# Altium schematic sheet Voeding.SchDoc
size A
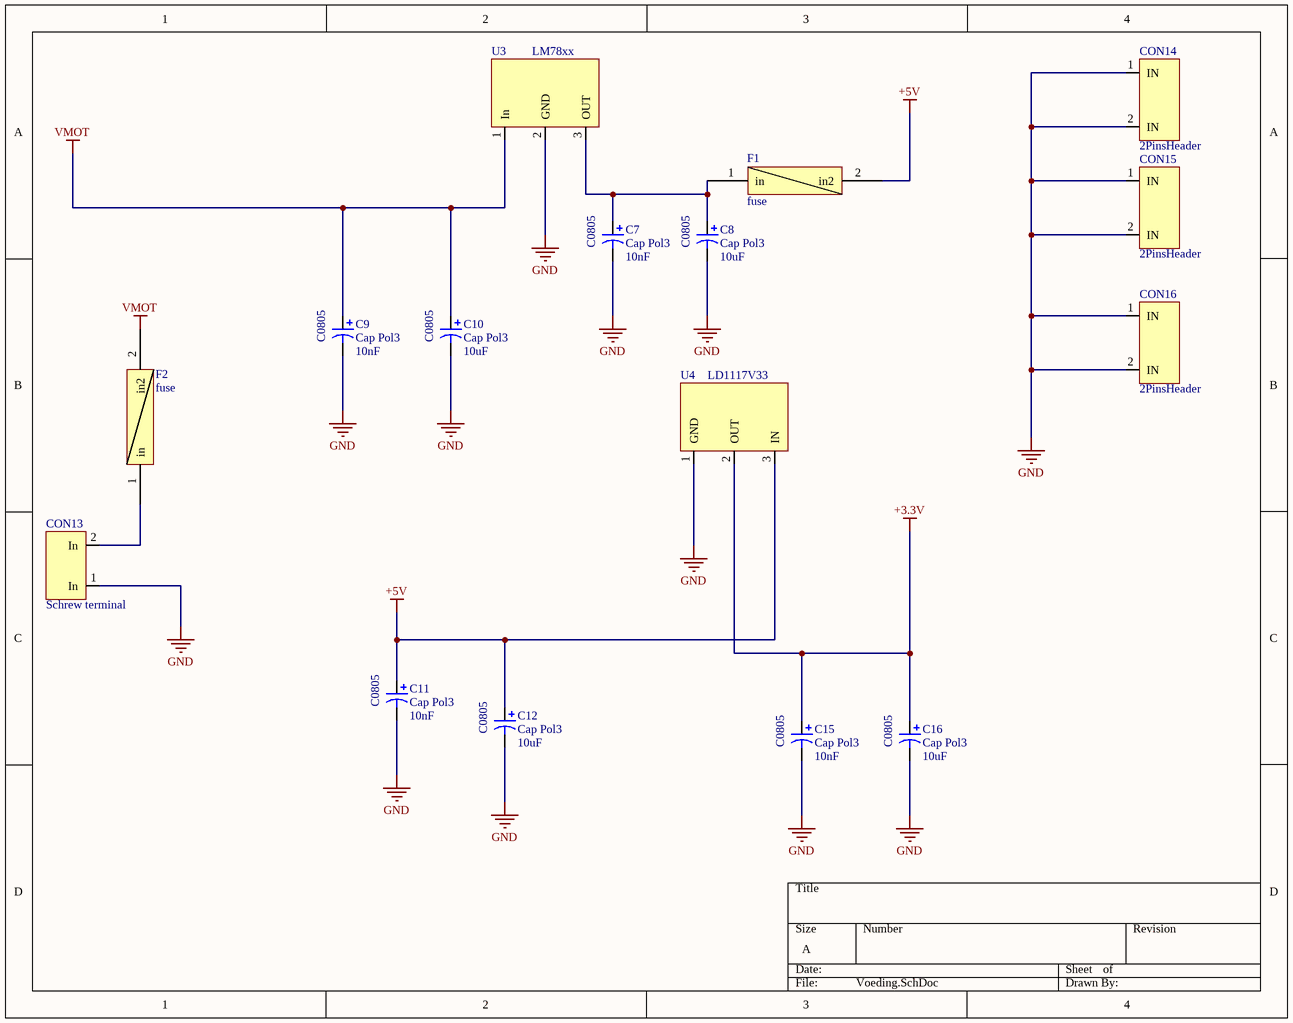
[diagram p0: Voeding.SchDoc]

## Parts
C7  Cap Pol3  value 10nF  [C0805]
C8  Cap Pol3  value 10uF  [C0805]
C9  Cap Pol3  value 10nF  [C0805]
C10  Cap Pol3  value 10uF  [C0805]
C11  Cap Pol3  value 10nF  [C0805]
C12  Cap Pol3  value 10uF  [C0805]
C15  Cap Pol3  value 10nF  [C0805]
C16  Cap Pol3  value 10uF  [C0805]
CON13  Schrew terminal  [ScrewTerminal]
CON14  2PinsHeader  [2PinsHeader]
CON15  2PinsHeader  [2PinsHeader]
CON16  2PinsHeader  [2PinsHeader]
F1  fuse  [Fuse]
F2  fuse  [Fuse]
U3  LM78xx  [LM78xx]
U4  LD1117V33  [LD117vxx]

## Nets
+3.3V: C15.1 C16.1 U4.2(OUT)
+5V: C11.1 C12.1 F1.2(in2) U4.3(IN)
GND: C7.2 C8.2 C9.2 C10.2 C11.2 C12.2 C15.2 C16.2 CON13.1(In) CON14.1(IN) CON14.2(IN) CON15.1(IN) CON15.2(IN) CON16.1(IN) CON16.2(IN) U3.2(GND) U4.1(GND)
VMOT: C9.1 C10.1 F2.2(in2) U3.1(In)
NetC7_1: C7.1 C8.1 F1.1(in) U3.3(OUT)
NetCON13_2: CON13.2(In) F2.1(in)

## Library data of the parts
C7-C12 C15 C16 = Cap Pol3: Polarized Capacitor (Surface Mount); Published: 8-Jun-2000; LatestRevisionDate: 29-May-2009; LatestRevisionNote: IPC-7351 Footprint Added.; PackageReference: C0805; Publisher: Altium Limited; PackageDescription: Chip Capacitor
F1 F2 = Component_1: fuse ptc